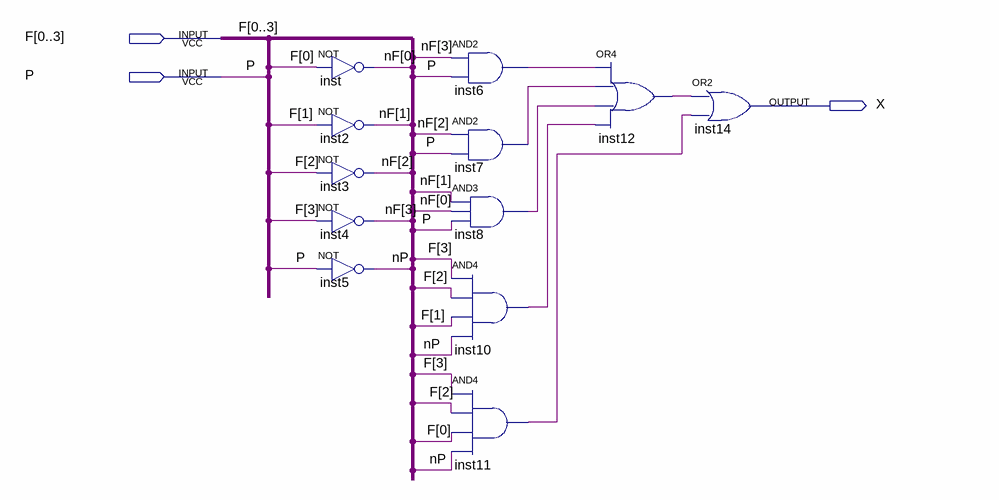
[diagram p0: schematic sheet]
// Quartus schematic Lnp.bdf as structural Verilog: 12 symbols, 3 pins
module Lnp (
  input  [0:3] F,
  input  P,
  output X
);

  wire inst6_out, inst7_out, inst8_out, inst10_out, inst11_out, inst12_out, nP;
  wire [3:0] nF;

  not inst (nF[0], F[0]);
  not inst2 (nF[1], F[1]);
  not inst3 (nF[2], F[2]);
  not inst4 (nF[3], F[3]);
  not inst5 (nP, P);
  and inst6 (inst6_out, nF[3], P);
  and inst7 (inst7_out, nF[2], P);
  and inst8 (inst8_out, nF[1], nF[0], P);
  and inst10 (inst10_out, F[3], F[2], F[1], nP);
  and inst11 (inst11_out, F[3], F[2], F[0], nP);
  or inst12 (inst12_out, inst6_out, inst7_out, inst8_out, inst10_out);
  or inst14 (X, inst12_out, inst11_out);
endmodule
